# Altium project LG-TRACKER.PrjPcb (part 2 of 2)

## Sheet LG_TRACKER_LoRa_Module.SchDoc
size A3; SheetNumber: 11; SheetTotal: 17
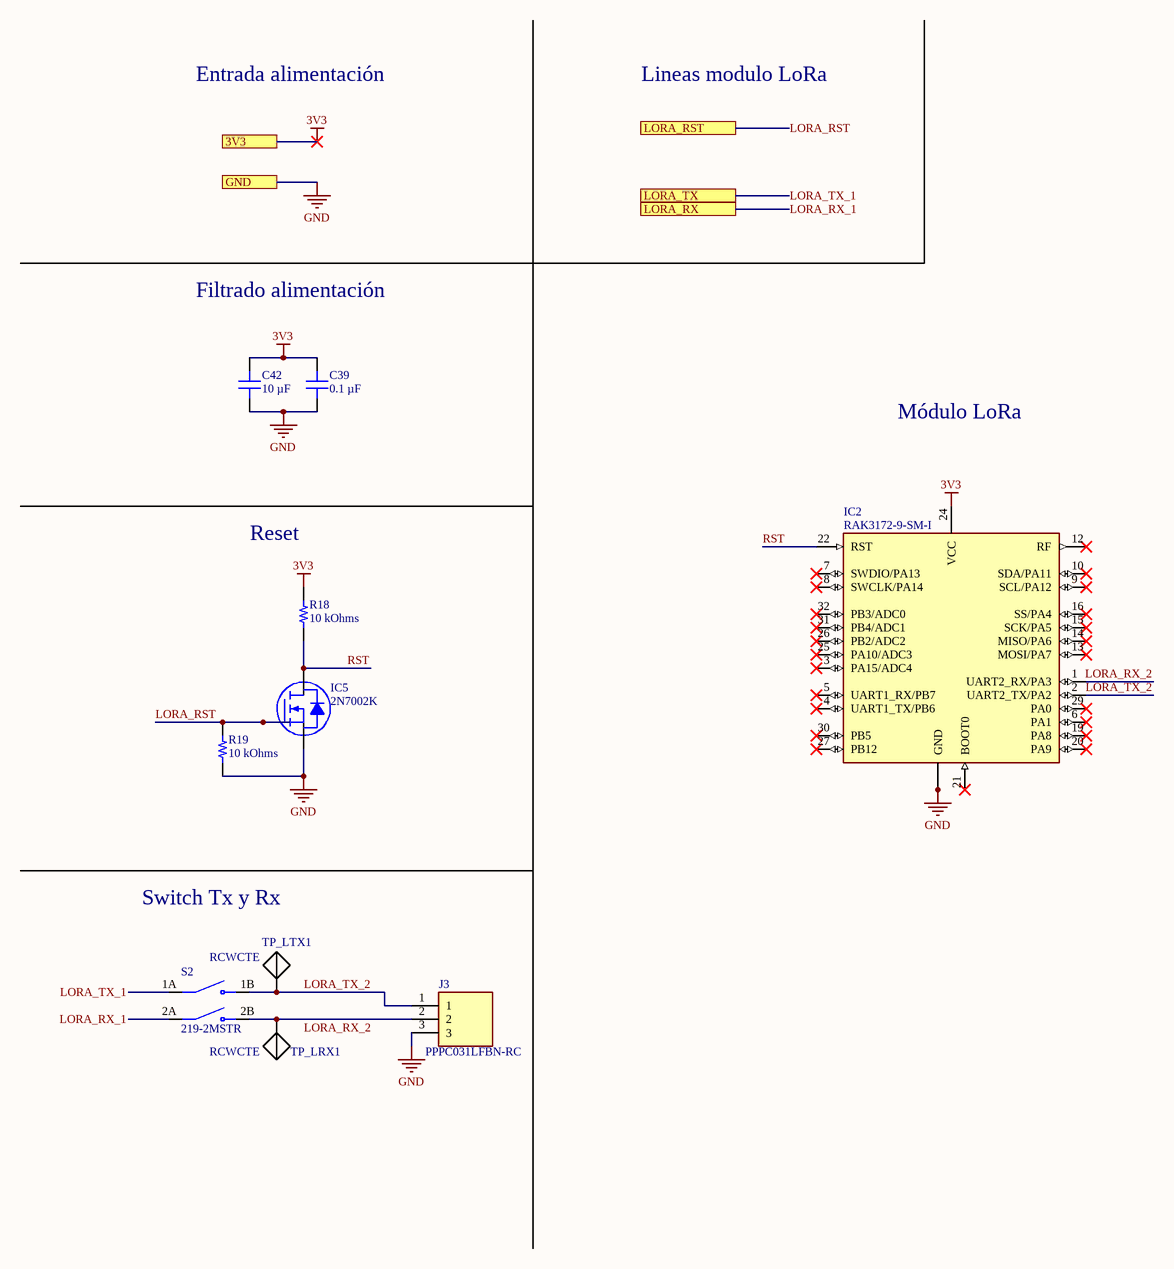
[diagram p6: LG_TRACKER_LoRa_Module.SchDoc]

### Parts
C39  0.1 µF  [MURATA GRM155 0402_1005]
C42  10 µF  [CAP 0805_2012]
IC2  RAK3172-9-SM-I  [RAK3172-9-SM-I]
IC5  2N7002K  [SOT23]
J3  PPPC031LFBN-RC  [PPPC031LFBN-RC]
R18  10 kOhms  [RES 0603_1608]
R19  10 kOhms  [RES 0603_1608]
S2  219-2MSTR  [SW_219-2MSTR]
TP_LRX1  RCWCTE  [RCWCTE]
TP_LTX1  RCWCTE  [RCWCTE]

### Ports
3V3, GND, LORA_RST, LORA_RX, LORA_TX

### Nets
3V3: C39.1 C42.2 IC2.24(VCC) R18.1 ; port 3V3
GND: C39.2 C42.1 IC2.11(GND) IC2.17(GND) IC2.18(GND) IC2.23(GND) IC2.28(GND) IC5.2(S) J3.3 R19.2 ; port GND
LORA_RST: IC5.1(G) R19.1 ; port LORA_RST
LORA_RX_1: S2.2A(COM2) ; port LORA_RX
LORA_RX_2: IC2.1(UART2_RX/PA3) J3.2 S2.2B(NO2) TP_LRX1.1(TP)
LORA_TX_1: S2.1A(COM1) ; port LORA_TX
LORA_TX_2: IC2.2(UART2_TX/PA2) J3.1 S2.1B(NO1) TP_LTX1.1(TP)
RST: IC2.22(RST) IC5.3(D) R18.2

Not connected (* = marked no-connect by the designer): IC2 3(PA15/ADC4)* 4(UART1_TX/PB6)* 5(UART1_RX/PB7)* 6(PA1)* 7(SWDIO/PA13)* 8(SWCLK/PA14)* 9(SCL/PA12)* 10(SDA/PA11)* 12(RF)* 13(MOSI/PA7)* 14(MISO/PA6)* 15(SCK/PA5)* 16(SS/PA4)* 19(PA8)* 20(PA9)* 21(BOOT0)* 25(PA10/ADC3)* 26(PB2/ADC2)* 27(PB12)* 29(PA0)* 30(PB5)* 31(PB4/ADC1)* 32(PB3/ADC0)*

### Notes on the sheet
- Entrada alimentación
- Lineas modulo LoRa
- Filtrado alimentación
- Módulo LoRa
- Reset
- Switch Tx y Rx

### Library data of the parts
C39 = GRM155R71H104KE14D: CAP CER 0.1UF 50V X7R 0402; manufacturer: Murata Electronics; Tolerance: ±10%; Part Number: GRM155R71H104KE14D; Value: 0.1 µF; Applications: General Purpose; Capacitance: 0.1 µF; componentlink1description: Datasheet; componentlink1url: https://search.murata.co.jp/Ceramy/image/img/A01X/G101/ENG/GRM155R71H104KE14-01.pdf; componentlink2description: DigiKey Link; componentlink2url: https://www.digikey.com/en/products/detail/murata-electronics/GRM155R71H104KE14D/4906220; Device Package: 0402 (1005 Metric); lastupdated: 8/27/2024 12:42:53 PM; Lifecycle Status: Active; Minimum Order: 1; Mounting Type: Surface Mount, MLCC; Operating Temperature: -55°C ~ 125°C; Package / Case: 0402 (1005 Metric); packaging: TapeAndReel; partid: 12677; Part Status: Active; price: 0.01; series: GRM; Size / Dimension: 0.039" L x 0.020" W (1.00mm x 0.50mm); Supplier 1: DigiKey; Supplier Part Number 1: 490-10700-1-ND; Temperature Coefficient: X7R; Thickness (Max): 0.022" (0.55mm); Voltage - Rated: 50V
C42 = CL21A106KOQNNNE: CAP CER 10UF 16V X5R 0805; manufacturer: Samsung Electro-Mechanics; Tolerance: ±10%; Part Number: CL21A106KOQNNNE; Value: 10 µF; Applications: General Purpose; Capacitance: 10 µF; componentlink1description: Datasheet; componentlink1url: http://www.samsungsem.com/kr/support/product-search/mlcc/CL21A106KOQNNNE.jsp; componentlink2description: DigiKey Link; componentlink2url: https://www.digikey.com/en/products/detail/samsung-electro-mechanics/CL21A106KOQNNNE/3886754; Device Package: 0805 (2012 Metric); lastupdated: 10/30/2023 7:13:57 PM; Lifecycle Status: Active; Minimum Order: 1; Mounting Type: Surface Mount, MLCC; Operating Temperature: -55°C ~ 85°C; Package / Case: 0805 (2012 Metric); packaging: TapeAndReel; partid: 14297; Part Status: Active; price: 0.01; series: CL; Size / Dimension: 0.079" L x 0.049" W (2.00mm x 1.25mm); Supplier 1: DigiKey; Supplier Part Number 1: 1276-1096-1-ND; Temperature Coefficient: X5R; Thickness (Max): 0.055" (1.40mm); Voltage - Rated: 16V
IC2 = RAK3172-9-SM-I: LoRaWAN module from RAK; MF: Shenzhen RAKwireless Technology Co.,Ltd.; Value: *; SnapEDA_Link: https://www.snapeda.com/parts/RAK3172/Shenzhen+RAKwireless+Technology+Co.%252CLtd./view-part/?ref=snap; Availability: Not in stock; Price: None; Package: Package; Check_prices: https://www.snapeda.com/parts/RAK3172/Shenzhen+RAKwireless+Technology+Co.%252CLtd./view-part/?ref=eda; MP: RAK3172-9-SM-I
IC5 = 2N7002K: MOSFET N-CH 60V 300MA SOT23; Manufacturer: ON Semiconductor; Current - Continuous Drain (Id) @ 25°C: 300mA (Ta); Drive Voltage (Max Rds On,  Min Rds On): 5V, 10V; FET Type: N-Channel; Input Capacitance (Ciss) (Max) @ Vds: 50pF @ 25V; Power Dissipation (Max): 350mW (Ta); Rds On (Max) @ Id, Vgs: 2Ohm @ 500mA, 10V; Vgs (Max): ±20V; Vgs(th) (Max) @ Id: 2.5V @ 250µA; Part Number: 2N7002K; ComponentLink1Description: Datasheet; ComponentLink1URL: https://www.onsemi.com/pub/Collateral/2N7002K-D.pdf; ComponentLink2Description: DigiKey Link; ComponentLink2URL: http://digikey.com/product-detail/en/on-semiconductor/2N7002K/2N7002KCT-ND/2060375; Drain to Source Voltage (Vdss): 60V; LastUpdated: 3/11/2024 8:04:14 AM; Lifecycle Status: Active; Minimum Order: 1; Mounting Type: Surface Mount; Operating Temperature: -55°C ~ 150°C (TJ); Package / Case: TO-236-3, SC-59, SOT-23-3; Packaging: TapeAndReel; Part Status: Active; Price: 0.07; Series: -; Supplier 1: DigiKey; Supplier Part Number 1: 2N7002KCT-ND; Supplier Device Package: SOT-23 (TO-236AB); Technology: MOSFET (Metal Oxide)
J3 = PPPC031LFBN-RC: Connector; Manufacturer_Name: Sullins; Datasheet Link: http://www.sullinscorp.com/drawings/78_P(N)PxCxxxLFBN-RC,_10492-H.pdf; Height: 8.5mm; Manufacturer_Part_Number: PPPC031LFBN-RC
R18 R19 = RC0603FR-0710KL: RES 10K OHM 1% 1/10W 0603; Manufacturer: Yageo; Power (Watts): 0.1W, 1/10W; Temperature Coefficient: ±100ppm/°C; Part Number: RC0603FR-0710KL; Value: 10 kOhms; ComponentLink1Description: Datasheet; ComponentLink1URL: https://www.yageo.com/upload/media/product/productsearch/datasheet/rchip/PYu-RC_Group_51_RoHS_L_10.pdf; ComponentLink2Description: DigiKey Link; ComponentLink2URL: https://www.digikey.com/en/products/detail/yageo/RC0603FR-0710KL/726880; Composition: Thick Film; Device Package: 0603 (1608 Metric); Features: Moisture Resistant; Height - Seated (Max): 0.022" (0.55mm); LastUpdated: 7/25/2024 9:19:19 AM; Lifecycle Status: Active; Minimum Order: 1; Number of Terminations: 2; Operating Temperature: -55°C ~ 155°C; Package / Case: 0603 (1608 Metric); Packaging: CutTape; PartId: 22599; Part Status: Active; Price: 0.01; Resistance: 10 kOhms; Series: RC_L; Size / Dimension: 0.063" L x 0.031" W (1.60mm x 0.80mm); Supplier 1: DigiKey; Supplier Part Number 1: 311-10.0KHRCT-ND; Supplier Device Package: 0603; Tolerance: ±1%
S2 = 219-2MSTR: Dip Switch SPST 2 Position Surface Mount Slide (Standard) Actuator 100mA 20VDC; MF: CTS Electrocomponents; SnapEDA_Link: https://www.snapeda.com/parts/219-2MSTR/CTS+Components/view-part/?ref=snap; Package: None; Value: *; MP: 219-2MSTR; Check_prices: https://www.snapeda.com/parts/219-2MSTR/CTS+Components/view-part/?ref=eda
TP_LRX1 TP_LTX1 = RCWCTE: - PC Test Point - - Plating Surface Mount Mounting Type; MF: KOA Speer; Check_prices: https://www.snapeda.com/parts/RCWCTE/KOA+Speer/view-part/?ref=eda; SnapEDA_Link: https://www.snapeda.com/parts/RCWCTE/KOA+Speer/view-part/?ref=snap; Digi-Key_Part_Number: 2019-RCWCTETR-ND; Value: *; Purchase-URL: https://pricing.snapeda.com/search/part/RCWCTE/?ref=eda; Package: None; MP: RCWCTE

## Sheet LG_TRACKER_DO.SchDoc
size A4; SheetNumber: 16; SheetTotal: 16
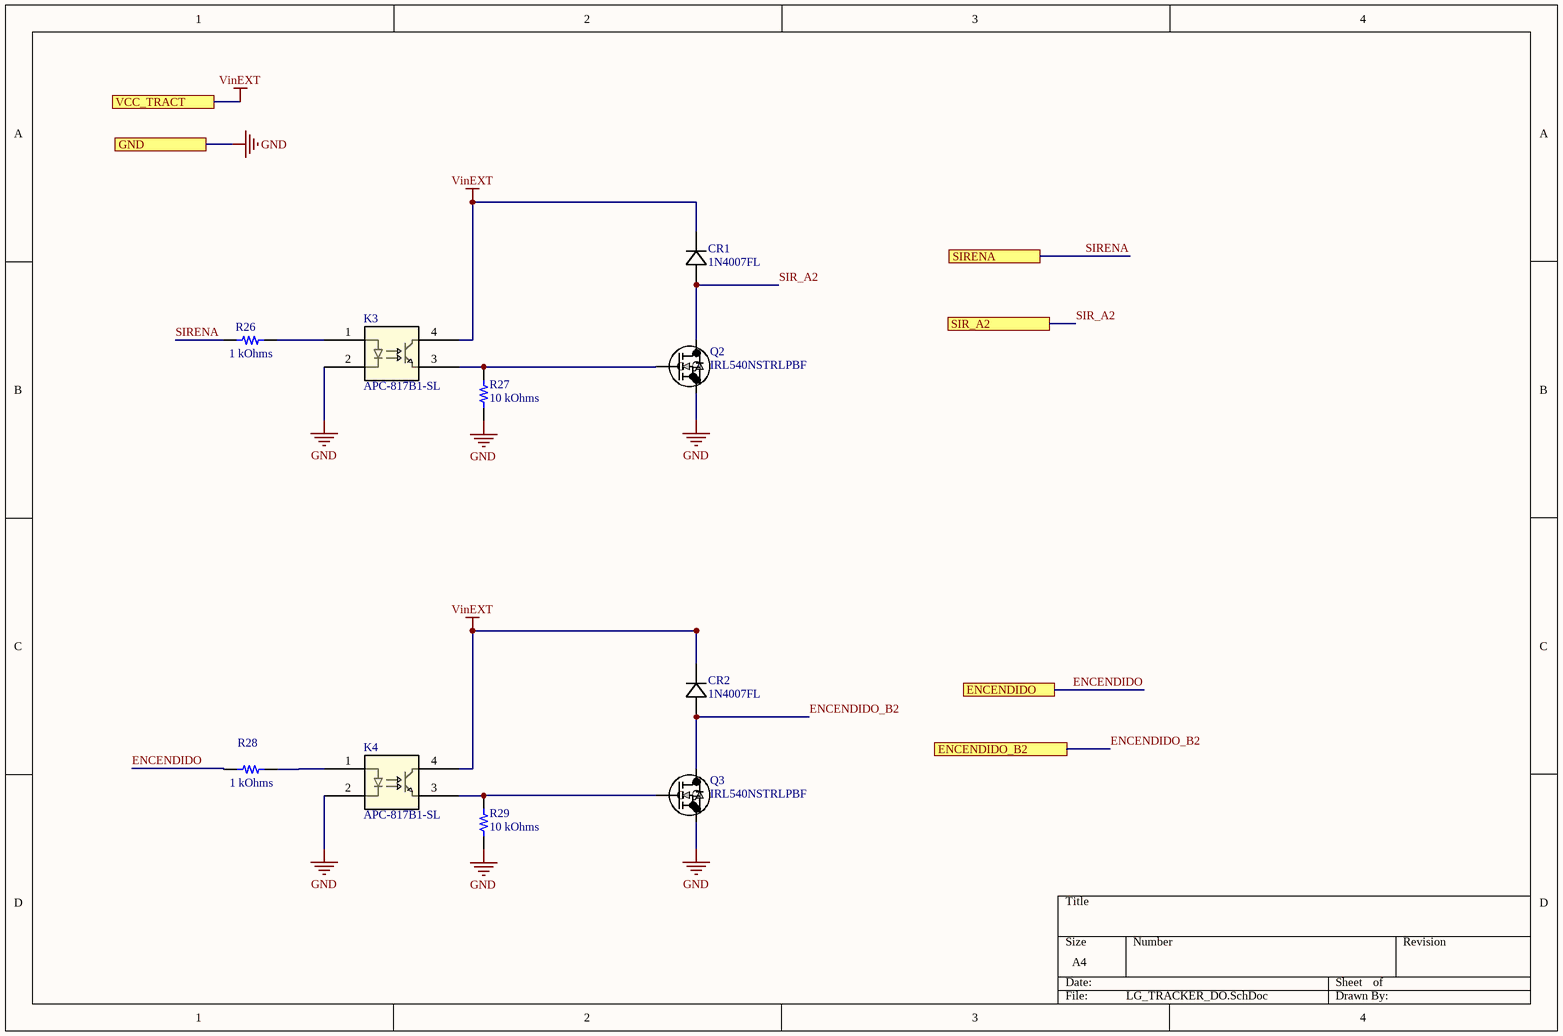
[diagram p7: LG_TRACKER_DO.SchDoc]

### Parts
CR1  1N4007FL  [CR_SOD-123FL_SME]
CR2  1N4007FL  [CR_SOD-123FL_SME]
K3  APC-817B1-SL  [APC-817xx-SL_AMB]
K4  APC-817B1-SL  [APC-817xx-SL_AMB]
Q2  IRL540NSTRLPBF  [NMOSGSD_D2PAK_IRL540NSTRLPBF_INF]
Q3  IRL540NSTRLPBF  [NMOSGSD_D2PAK_IRL540NSTRLPBF_INF]
R26  1 kOhms  [RES 0402_1005]
R27  10 kOhms  [RES 0603_1608]
R28  1 kOhms  [RES 0402_1005]
R29  10 kOhms  [RES 0603_1608]

### Ports
ENCENDIDO, ENCENDIDO_B2, GND, SIR_A2, SIRENA, VCC_TRACT

### Nets
GND: K3.2 K4.2 Q2.2(S) Q3.2(S) R27.1 R29.1 ; port GND
VinEXT: CR1.1(CATHODE) CR2.1(CATHODE) K3.4 K4.4 ; port VCC_TRACT
ENCENDIDO: R28.1 ; port ENCENDIDO
ENCENDIDO_B2: CR2.2(ANODE) Q3.3(D) ; port ENCENDIDO_B2
SIR_A2: CR1.2(ANODE) Q2.3(D) ; port SIR_A2
SIRENA: R26.1 ; port SIRENA
NetK3_1: K3.1 R26.2
NetK3_3: K3.3 Q2.1(G) R27.2
NetK4_1: K4.1 R28.2
NetK4_3: K4.3 Q3.1(G) R29.2

### Library data of the parts
CR1 CR2 = 1N4007FL: Description; Manufacturer_Name: SMC Diode Solutions; Copyright: Copyright (C) 2025 Ultra Librarian. All rights reserved.; Manufacturer_Part_Number: 1N4007FL
K3 K4 = APC-817B1-SL: Description; Manufacturer_Name: American Bright; Type: Optoisolators; Copyright: Copyright (C) 2025 Ultra Librarian. All rights reserved.; Manufacturer_Part_Number: APC-817B1-SL; RefDes: RefDes
Q2 Q3 = IRL540NSTRLPBF: Description; Manufacturer_Name: Infineon; Copyright: Copyright (C) 2025 Ultra Librarian. All rights reserved.; Manufacturer_Part_Number: IRL540NSTRLPBF
R26 R28 = AT0402BRD071KL: RES SMD 1K OHM 0.1% 1/16W 0402; Manufacturer: Yageo; Power (Watts): 0.063W, 1/16W; Temperature Coefficient: ±25ppm/°C; Part Number: AT0402BRD071KL; Value: 1 kOhms; ComponentLink1Description: Datasheet; ComponentLink1URL: http://www.yageo.com/documents/recent/PYu-AT_51_RoHS_L_5.pdf; ComponentLink2Description: DigiKey Link; ComponentLink2URL: https://www.digikey.com/en/products/detail/yageo/AT0402BRD071KL/5138607; Composition: Thin Film; Device Package: 0402 (1005 Metric); Features: Anti-Sulfur, Automotive AEC-Q200, Moisture Resistant; Height - Seated (Max): 0.014" (0.35mm); LastUpdated: 31/8/2025 15:04:18; Lifecycle Status: Active; Minimum Order: 1; Number of Terminations: 2; Operating Temperature: -55°C ~ 155°C; Package / Case: 0402 (1005 Metric); Packaging: TapeAndReel; PartId: 2462; Part Status: Active; Price: 0.09; Ratings: AEC-Q200; Resistance: 1 kOhms; Series: AT; Size / Dimension: 0.039" L x 0.020" W (1.00mm x 0.50mm); Supplier 1: DigiKey; Supplier Part Number 1: YAG2088CT-ND; Supplier Device Package: 0402; Tolerance: ±0.1%
R27 R29 = RC0603FR-0710KL: as R18 on sheet LG_TRACKER_LoRa_Module; Part Number: RC0603FR-0710KL; Value: 10 kOhms; ComponentLink1Description: Datasheet; ComponentLink1URL: https://www.yageo.com/upload/media/product/productsearch/datasheet/rchip/PYu-RC_Group_51_RoHS_L_10.pdf; ComponentLink2Description: DigiKey Link; ComponentLink2URL: https://www.digikey.com/en/products/detail/yageo/RC0603FR-0710KL/726880; Composition: Thick Film; Device Package: 0603 (1608 Metric); Features: Moisture Resistant; Height - Seated (Max): 0.022" (0.55mm); LastUpdated: 10/30/2023 7:36:43 PM; Lifecycle Status: Active; Minimum Order: 1; Number of Terminations: 2; Operating Temperature: -55°C ~ 155°C; Package / Case: 0603 (1608 Metric); Packaging: CutTape; PartId: 22599; Part Status: Active; Price: 0.01; Resistance: 10 kOhms; Series: RC_L; Size / Dimension: 0.063" L x 0.031" W (1.60mm x 0.80mm); Supplier 1: DigiKey; Supplier Part Number 1: 311-10.0KHRCT-ND; Supplier Device Package: 0603; Tolerance: ±1%

## Nets that join several sheets
3V3: LG_TRACKER_BG95 (C28.2 IC4.8 R13.2), LG_TRACKER_Linear_Voltage_Regulator_3V3 (C7.2 TP_3V3.1 U1.2), LG_TRACKER_LoRa_Module (C39.1 C42.2 IC2.24 R18.1)
3V3_ESP32: LG_TRACKER_Microcontroller (7 pins), LG_TRACKER_IO_Expanders (C13.2 C14.2 U3.16)
GND: LG_TRACKER_Block_Diagram (10 pins), LG_TRACKER_Microcontroller (23 pins), LG_TRACKER_IO_Expanders (6 pins), LG_TRACKER_BG95 (51 pins), LG_TRACKER_Linear_Voltage_Regulator_3V3 (C6.2 C7.1 U1.1), LG_TRACKER_LoRa_Module (10 pins), LG_TRACKER_DO (6 pins)
VinEXT: LG_TRACKER_Block_Diagram (B1.1 B1.2 B1.3 D1.2), LG_TRACKER_DO (CR1.1 CR2.1 K3.4 K4.4)
AIN0: LG_TRACKER_Block_Diagram (J5.2), LG_TRACKER_Microcontroller (U2.5)
EN: LG_TRACKER_Block_Diagram (J13.1), LG_TRACKER_Microcontroller (C15.2 R10.1 U2.3)
ENCENDIDO: LG_TRACKER_IO_Expanders (U3.6), LG_TRACKER_DO (R28.1)
ENCENDIDO_B2: LG_TRACKER_Block_Diagram (J8.2), LG_TRACKER_DO (CR2.2 Q3.3)
GPIO0: LG_TRACKER_Block_Diagram (J13.6), LG_TRACKER_Microcontroller (U2.25)
GREEN_LED: LG_TRACKER_Microcontroller (C41.2 R9.1), LG_TRACKER_IO_Expanders (U3.4)
LORA_RST: LG_TRACKER_Microcontroller (U2.4), LG_TRACKER_LoRa_Module (IC5.1 R19.1)
LORA_RX_1: LG_TRACKER_Microcontroller (U2.11 U2.36), LG_TRACKER_LoRa_Module (S2.2A)
LORA_TX_1: LG_TRACKER_Microcontroller (U2.12), LG_TRACKER_LoRa_Module (S2.1A)
MODEM_DTR: LG_TRACKER_IO_Expanders (U3.12), LG_TRACKER_BG95 (R20.2)
MODEM_PWRKEY: LG_TRACKER_IO_Expanders (U3.11), LG_TRACKER_BG95 (Q1.2 R14.1)
MODEM_RX: LG_TRACKER_Microcontroller (U2.31), LG_TRACKER_BG95 (IC4.6 TP_MRX.1)
MODEM_STATUS: LG_TRACKER_IO_Expanders (U3.10), LG_TRACKER_BG95 (Q1.3 R13.1 TP_STATUS.1)
MODEM_TX: LG_TRACKER_Microcontroller (U2.33), LG_TRACKER_BG95 (IC4.7 TP_MTX.1)
SCL: LG_TRACKER_Microcontroller (R8.1 TP_SCL.1 U2.9), LG_TRACKER_IO_Expanders (U3.14)
SDA: LG_TRACKER_Microcontroller (R7.1 TP_SDA.1 U2.8), LG_TRACKER_IO_Expanders (U3.15)
SIR_A2: LG_TRACKER_Block_Diagram (J8.1), LG_TRACKER_DO (CR1.2 Q2.3)
SIRENA: LG_TRACKER_IO_Expanders (U3.5), LG_TRACKER_DO (R26.1)
TCK: LG_TRACKER_Block_Diagram (J2.4), LG_TRACKER_Microcontroller (U2.16)
TDI: LG_TRACKER_Block_Diagram (J2.8), LG_TRACKER_Microcontroller (U2.14)
TDO: LG_TRACKER_Block_Diagram (J2.6), LG_TRACKER_Microcontroller (U2.23)
TMS: LG_TRACKER_Block_Diagram (J2.2), LG_TRACKER_Microcontroller (U2.13)
UART0_RX: LG_TRACKER_Block_Diagram (J13.5), LG_TRACKER_Microcontroller (U2.34)
UART0_TX: LG_TRACKER_Block_Diagram (J13.3), LG_TRACKER_Microcontroller (U2.35)